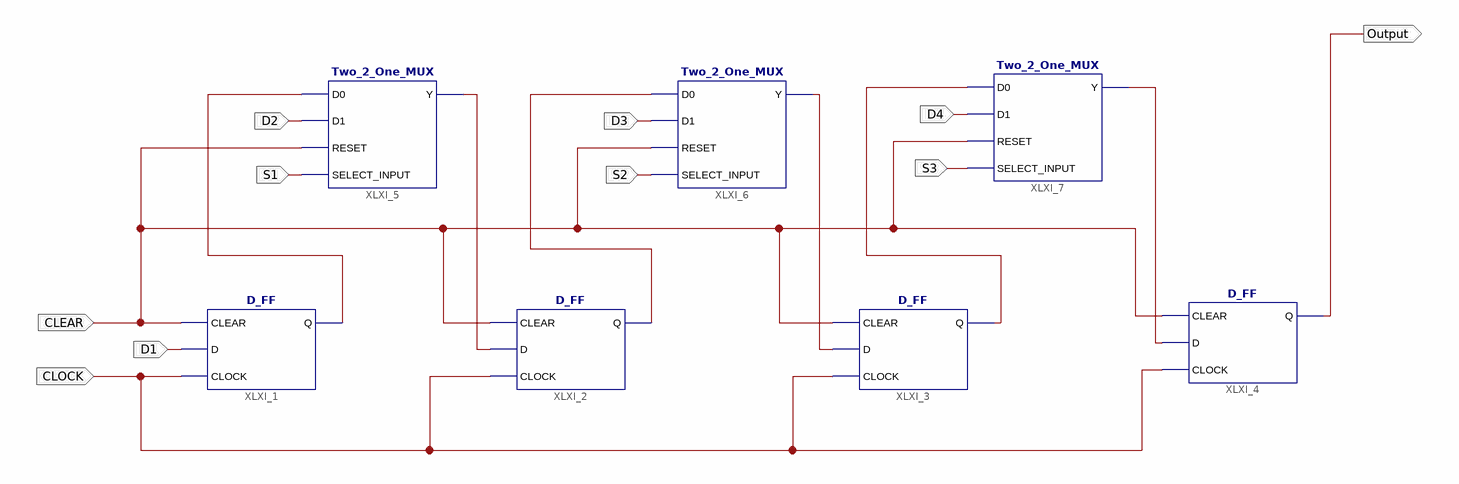
[diagram p0: schematic sheet 1]
// Xilinx ISE schematic PISO.sch (artix7) as structural Verilog: 7 symbols, 10 ports
module PISO (
  input  CLOCK,
  input  S2,
  input  S3,
  input  CLEAR,
  input  D2,
  input  D3,
  input  D4,
  input  D1,
  input  S1,
  output Output
);

  wire Q1, Q2, Q3, XLXN_33, XLXN_34, XLXN_36;

  D_FF XLXI_1 (.CLEAR(CLEAR), .CLOCK(CLOCK), .D(D1), .Q(XLXN_33));
  D_FF XLXI_2 (.CLEAR(CLEAR), .CLOCK(CLOCK), .D(Q1), .Q(XLXN_34));
  D_FF XLXI_4 (.CLEAR(CLEAR), .CLOCK(CLOCK), .D(Q3), .Q(Output));
  D_FF XLXI_3 (.CLEAR(CLEAR), .CLOCK(CLOCK), .D(Q2), .Q(XLXN_36));
  Two_2_One_MUX XLXI_5 (.D0(XLXN_33), .D1(D2), .RESET(CLEAR), .SELECT_INPUT(S1), .Y(Q1));
  Two_2_One_MUX XLXI_6 (.D0(XLXN_34), .D1(D3), .RESET(CLEAR), .SELECT_INPUT(S2), .Y(Q2));
  Two_2_One_MUX XLXI_7 (.D0(XLXN_36), .D1(D4), .RESET(CLEAR), .SELECT_INPUT(S3), .Y(Q3));
endmodule
